# EAGLE design tvbgone (EAGLE 7.3.0)
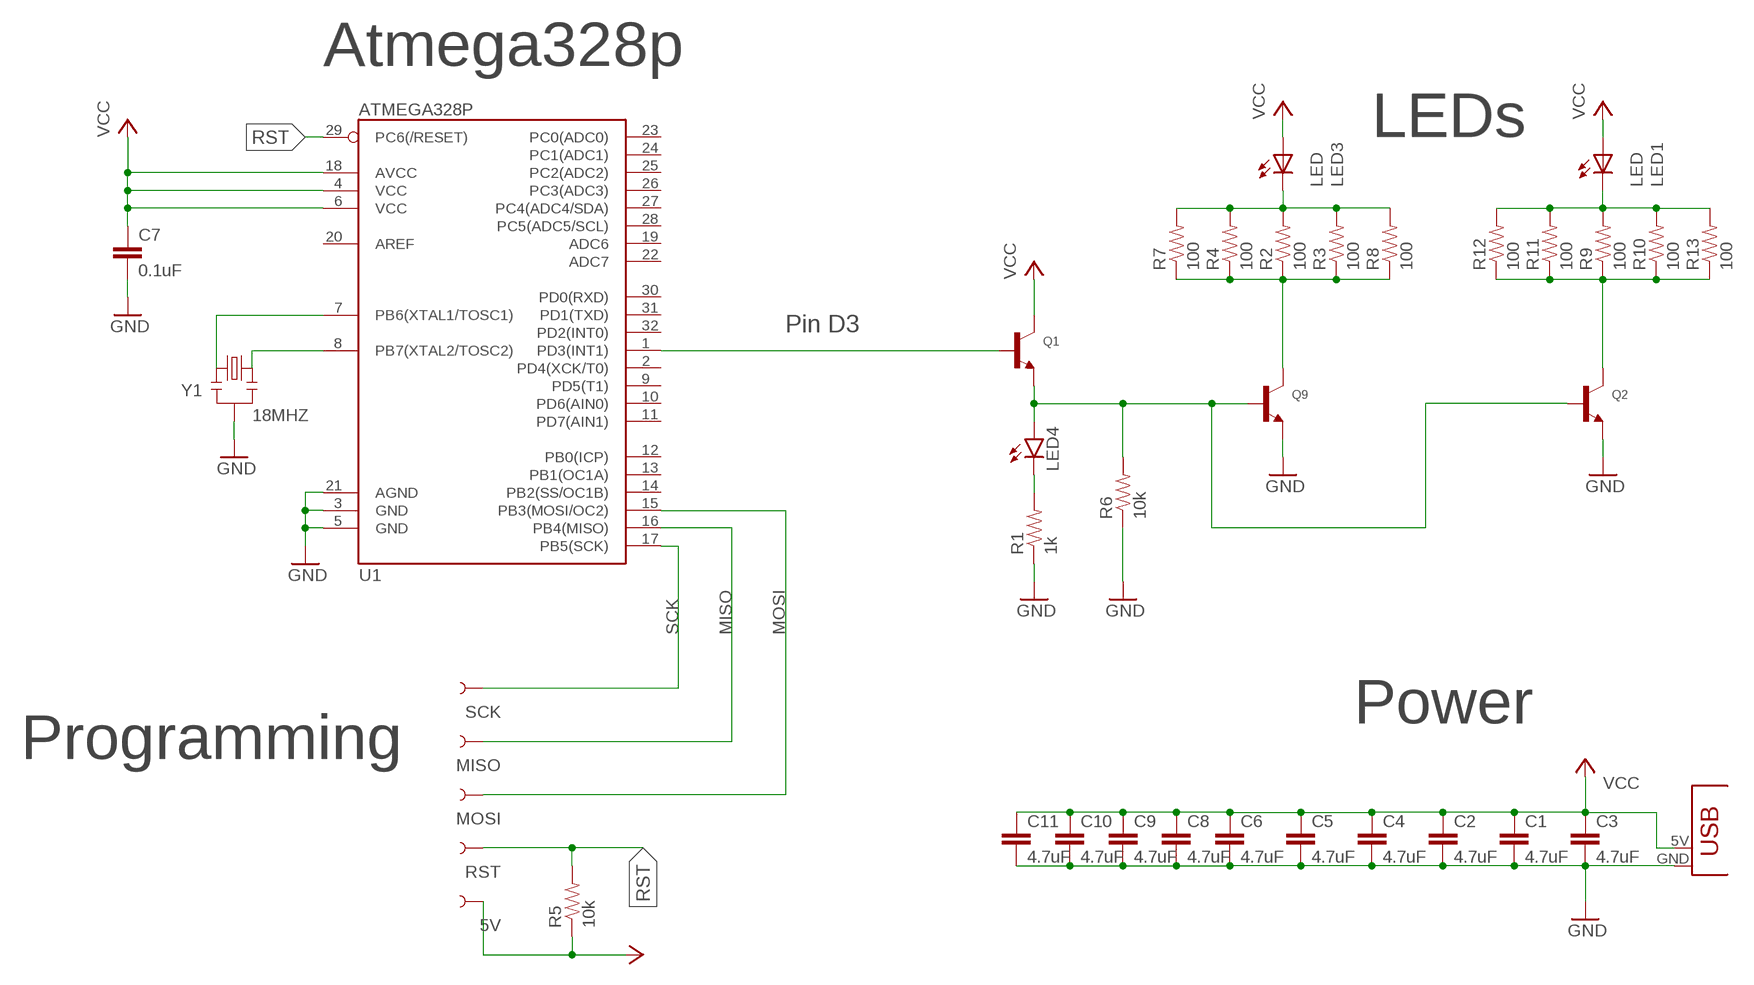
[diagram p0: schematic, sheet 1]

## Parts
5V  TEST-POINT3X5  [PAD.03X.05]
C1  4.7uF  CAP0603-CAP  [0603-CAP]
C2  4.7uF  CAP0603-CAP  [0603-CAP]
C3  4.7uF  CAP0603-CAP  [0603-CAP]
C4  4.7uF  CAP0603-CAP  [0603-CAP]
C5  4.7uF  CAP0603-CAP  [0603-CAP]
C6  4.7uF  CAP0603-CAP  [0603-CAP]
C7  0.1uF  CAP0603-CAP  [0603-CAP]
C8  4.7uF  CAP0603-CAP  [0603-CAP]
C9  4.7uF  CAP0603-CAP  [0603-CAP]
C10  4.7uF  CAP0603-CAP  [0603-CAP]
C11  4.7uF  CAP0603-CAP  [0603-CAP]
LED1  LED  [5MM-SIDE]
LED3  LED  [5MM-SIDE]
LED4  LED0603  [LED-0603]
MISO  TEST-POINT3X5  [PAD.03X.05]
MOSI  TEST-POINT3X5  [PAD.03X.05]
Q1  TRANSISTOR_NPN  [SOT-23-R]
Q2  TRANSISTOR_NPN  [SOT-23-R]
Q9  TRANSISTOR_NPN  [SOT-23-R]
R1  1k  RESISTOR0603  [0603-RES]
R2  100  RESISTOR0603  [0603-RES]
R3  100  RESISTOR0603  [0603-RES]
R4  100  RESISTOR0603  [0603-RES]
R5  10k  RESISTOR0603  [0603-RES]
R6  10k  RESISTOR0603  [0603-RES]
R7  100  RESISTOR0603  [0603-RES]
R8  100  RESISTOR0603  [0603-RES]
R9  100  RESISTOR0603  [0603-RES]
R10  100  RESISTOR0603  [0603-RES]
R11  100  RESISTOR0603  [0603-RES]
R12  100  RESISTOR0603  [0603-RES]
R13  100  RESISTOR0603  [0603-RES]
RST  TEST-POINT3X5  [PAD.03X.05]
SCK  TEST-POINT3X5  [PAD.03X.05]
U1  ATMEGA328P  ATMEGA328_SMT  [TQFP32-08]
U$1  USB-POWER-ONLY  [USB-A-PCB-POWER-ONLY]
Y1  18MHZ  RESONATOR8MHZ  [RESONATOR-SMD]

## Nets
GND: C1.2 C2.2 C3.2 C4.2 C5.2 C6.2 C7.2 C8.2 C9.2 C10.2 C11.2 Q2.3-EMITTER(E) Q9.3-EMITTER(E) R1.1 R6.1 U1.3(GND) U1.5(GND) U1.21(AGND) U$1.GND Y1.2
MISO: MISO.P$1 U1.16(PB4(MISO))
MOSI: MOSI.P$1 U1.15(PB3(MOSI/OC2))
N$1: U1.8(PB7(XTAL2/TOSC2)) Y1.3
N$2: U1.7(PB6(XTAL1/TOSC1)) Y1.1
N$3: LED4.C R1.2
N$4: Q2.2-COLLECTOR(C) R9.1 R10.1 R11.1 R12.1 R13.1
N$6: Q1.1-BASE(B) U1.1(PD3(INT1))
N$8: LED1.K(C) R9.2 R10.2 R11.2 R12.2 R13.2
N$10: LED4.A Q1.3-EMITTER(E) Q2.1-BASE(B) Q9.1-BASE(B) R6.2
N$11: Q9.2-COLLECTOR(C) R2.1 R3.1 R4.1 R7.1 R8.1
N$12: LED3.K(C) R2.2 R3.2 R4.2 R7.2 R8.2
RST: R5.2 RST.P$1 U1.29(PC6(/RESET))
SCK: SCK.P$1 U1.17(PB5(SCK))
VCC: 5V.P$1 C1.1 C2.1 C3.1 C4.1 C5.1 C6.1 C7.1 C8.1 C9.1 C10.1 C11.1 LED1.A LED3.A Q1.2-COLLECTOR(C) R5.1 U1.4(VCC) U1.6(VCC) U1.18(AVCC) U$1.5V(VBUS)
Unconnected: U1.2(PD4(XCK/T0)) U1.9(PD5(T1)) U1.10(PD6(AIN0)) U1.11(PD7(AIN1)) U1.12(PB0(ICP)) U1.13(PB1(OC1A)) U1.14(PB2(SS/OC1B)) U1.19(ADC6) U1.20(AREF) U1.22(ADC7) U1.23(PC0(ADC0)) U1.24(PC1(ADC1)) U1.25(PC2(ADC2)) U1.26(PC3(ADC3)) U1.27(PC4(ADC4/SDA)) U1.28(PC5(ADC5/SCL)) U1.30(PD0(RXD)) U1.31(PD1(TXD)) U1.32(PD2(INT0))

## Notes on the sheet
- Atmega328p
- LEDs
- Pin D3
- Power
- Programming

## Library data of the parts
5V MISO MOSI RST SCK = SparkFun-Passives:TEST-POINT: Bare copper test points for troubleshooting or ICT
C1-C11 = homemade-hardware:CAP: Capacitor Standard 0603 ceramic capacitor, and 0.1" leaded capacitor.
LED1 LED3 = tvbgone:LED
LED4 = homemade-hardware:LED: LEDs Standard schematic elements and footprints for 5mm, 3mm, 1206, and 0603 sized LEDs. 5mm - Spark Fun Electronics SKU : COM-00529 (and others)
Q1 Q2 Q9 = Tomorrow_Lab_LLC:TRANSISTOR_NPN: NPN Transistor Transistor (NPN) 500mA 45V - BC817 [Digikey: 568-1631-1-ND] SOT23-R - SOT23 footprint optimised for use with solder paste and reflow ovens. SOT23-W - SOT23 footprint optimised for hand-soldering (larger pads).
R1-R13 = homemade-hardware:RESISTOR: Resistor Basic schematic elements and footprints for 0603, 1206, and PTH resistors.
U1 = SparkFun-DigitalIC:ATMEGA328_SMT: 32-Pin Atmega328 part Commonly used on Arduino compatible boards Available in QFP and QFN packages TQFP is IC-09069 QFN is non-stock; PROD_ID: IC-09069
U$1 = Andy_Sigler:USB-POWER-ONLY
Y1 = homemade-hardware:RESONATOR: Resonator Small SMD resonator. Used, eg, on the Arduino Pro/ Pro Mini boards. 8MHz- XTAL-08895 16MHz- XTAL-08900; PROD_ID: XTAL-08895; VALUE: 8MHZ

## Board
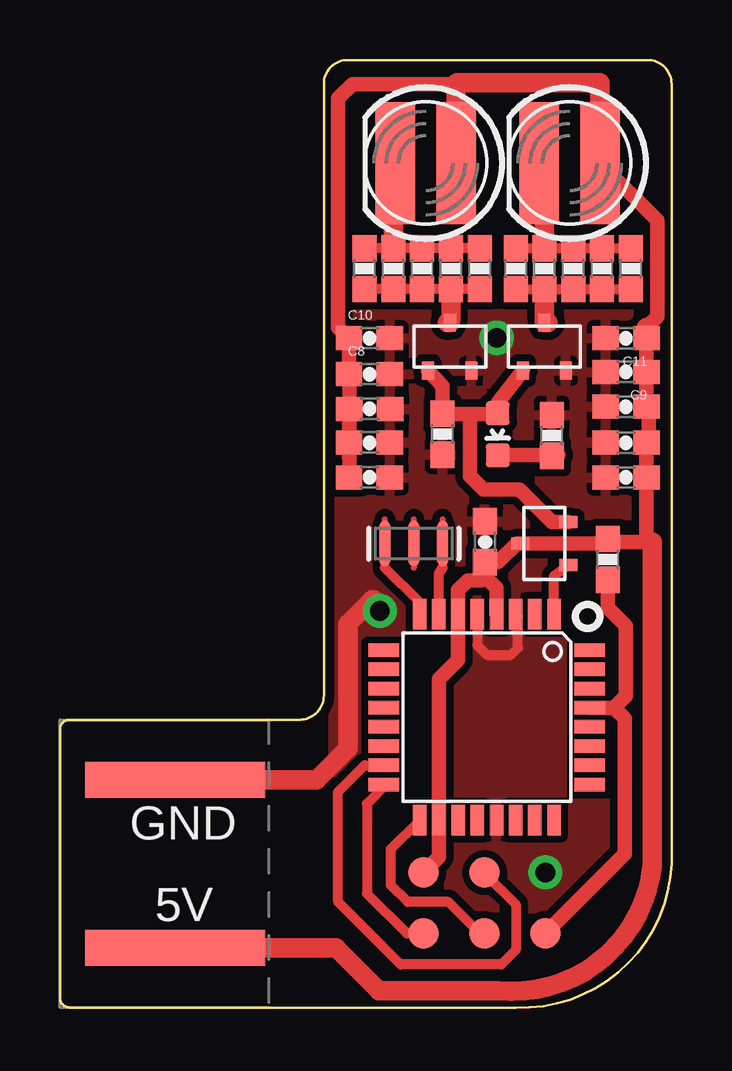
[diagram p1: board, top side]
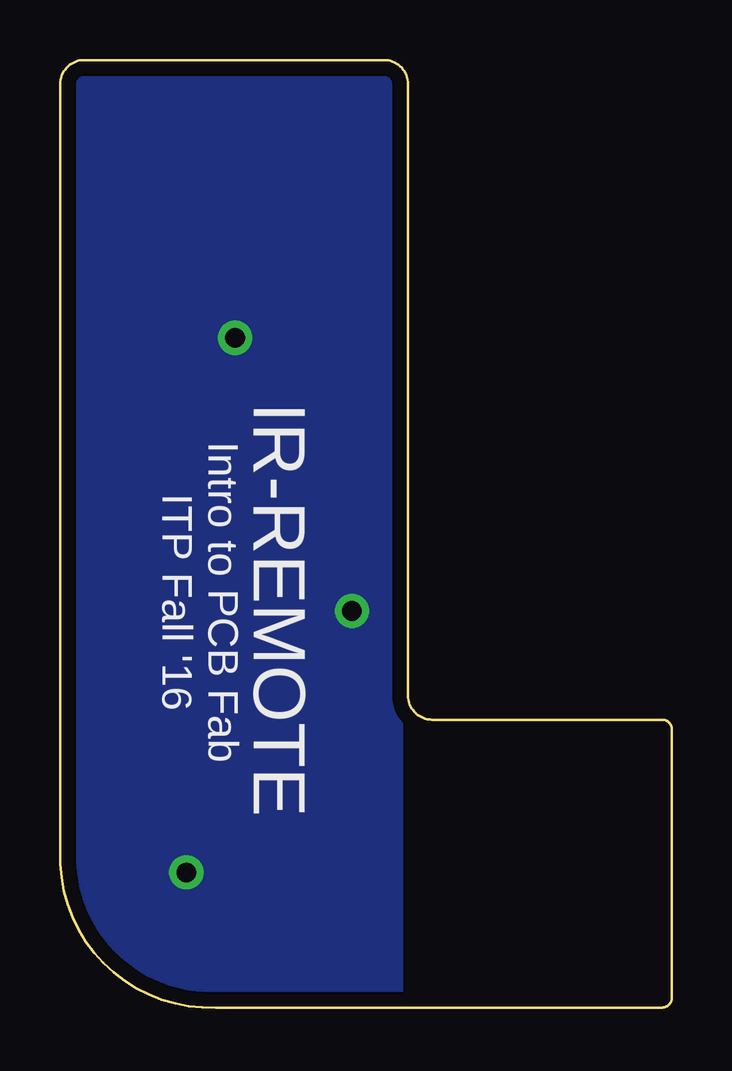
[diagram p2: board, bottom side, seen from below]

Size 25.5 x 39.5 mm. Coordinates in mm from the lower left corner, seen from the top.
Outline: 0.4,12 arc90 0,11.6 0,0.4 arc90 0.4,0 19,0 arc90 25.5,6 25.5,38.5 arc90 24.5,39.5 12,39.5 arc90 11,38.5 11,13 arc-90 10,12 0.4,12
Copper layers (1*16): Top 0.0356mm / dielectric 1.5011mm / Bottom 0.0356mm
Design rules "LaenPCBOrder": minimum track width 6mil, minimum drill 13mil, track to track 6mil, track to pad 6mil, pad to pad 6mil, via to via 6mil, smd to smd 6mil, copper to edge 15mil, drill to drill 6mil, minimum pad ring 7mil, minimum via ring 7mil, stop-mask expansion 3mil, vias tented up to drill 0mil, thermal gap 10mil

### Footprints (pad centres in the part's own frame; a part is rotated, then mirrored left to right if it is on the bottom)
PAD.03X.05 = smd 1.27 x 1.27: P$1 0,0
0603-CAP = smd 1.1 x 1: 1 -0.85,0; 2 0.85,0
5MM-SIDE = smd 1.651 x 5.08: A -1.27,0; K 1.27,0
LED-0603 = smd 1 x 1: A 0,-0.877; C 0,0.877
SOT-23-R = smd 0.5 x 0.75: 1-BASE -0.9,-1; 2-COLLECTOR 0,1; 3-EMITTER 0.9,-1
0603-RES = smd 1.1 x 1: 1 -0.85,0; 2 0.85,0
TQFP32-08 = smd 1.27 x 0.559: 1 -4.293,2.8; 2 -4.293,2; 3 -4.293,1.2; 4 -4.293,0.4; 5 -4.293,-0.4; 6 -4.293,-1.2; 7 -4.293,-2; 8 -4.293,-2.8; 17 4.293,-2.8; 18 4.293,-2; 19 4.293,-1.2; 20 4.293,-0.4; 21 4.293,0.4; 22 4.293,1.2; 23 4.293,2; 24 4.293,2.8 | smd 0.559 x 1.27: 9 -2.8,-4.293; 10 -2,-4.293; 11 -1.2,-4.293; 12 -0.4,-4.293; 13 0.4,-4.293; 14 1.2,-4.293; 15 2,-4.293; 16 2.8,-4.293; 25 2.8,4.293; 26 2,4.293; 27 1.2,4.293; 28 0.4,4.293; 29 -0.4,4.293; 30 -1.2,4.293; 31 -2,4.293; 32 -2.8,4.293
USB-A-PCB-POWER-ONLY = smd 7.5 x 1.5: 5V -0.2,-3.5; GND -0.2,3.5
RESONATOR-SMD = smd 0.45 x 1.905: 1 -1.2,0; 2 0,0; 3 1.2,0

### Placement (x,y rotation side)
5V  15.16,5.63 180 top
C1  23.6,23.55 180 top
C2  12.9,23.55 0 top
C3  12.92,24.96 0 top
C4  23.6,25.05 180 top
C5  12.9,22.1 0 top
C6  23.6,22.1 180 top
C7  17.73,19.42 90 top
C8  12.9,26.4 0 top
C9  23.6,26.5 180 top
C10  12.9,27.9 0 top
C11  23.6,27.9 180 top
LED1  15.25,35.2 180 top
LED3  21.25,35.2 180 top
LED4  18.25,23.9 180 top
MISO  15.16,3.09 180 top
MOSI  17.7,5.63 180 top
Q1  20.2,19.35 90 top
Q2  16.25,27.55 0 top
Q9  20.2,27.55 0 top
R1  20.5,23.85 270 top
R2  19,30.8 90 top
R3  20.2,30.8 90 top
R4  21.4,30.8 90 top
R5  22.83,18.68 270 top
R6  15.95,23.9 90 top
R7  22.6,30.8 90 top
R8  23.8,30.8 90 top
R9  17.5,30.8 90 top
R10  12.7,30.8 90 top
R11  15.1,30.8 90 top
R12  13.9,30.8 90 top
R13  16.3,30.8 90 top
RST  20.24,3.09 180 top
SCK  17.7,3.09 180 top
U1  17.8,12.1 270 top
U$1  5,6 0 top
Y1  14.75,19.34 180 top

### Tracks (layer width: path | path; a pad name or v marks a point on that pad's centre or on a via)
GND  (via drill 0.82 pad 1.42)
  Top 0.406: U1.5 17.4,15.1 17.8,14.7 18.8,14.7 19.1,15 19.1,16.29 U1.3
  Top 0.813: U$1.GND 10.7,9.5 12,10.8 12,16 13,17 13.07,17 v13.34,16.53
  other vias: 20.24,5.63 18.21,27.92
  pour Top (isolate 0.305): 11.4,40 27,40 27,-1 11.4,-1
  pour Bottom (isolate 0.61): 11.5,39.75 27,39.75 27,-1 11.5,-1
MISO
  Top 0.406: MISO.P$1 14.46,3.09 12.8,4.75 12.8,8.5 13.6,9.3 U1.16
MOSI
  Top 0.406: MOSI.P$1 17.7,5.6 19,4.3 19,2.4 18.4,1.8 14.2,1.8 11.6,4.4 11.6,9 12.7,10.1 U1.15
N$1
  Top 0.406: U1.8 15,16.88 13.55,18.33
N$2
  Top 0.406: U1.7 15.8,18.08 15.95,18.33
N$3
  Top 0.61: LED4.C 20.78,23.02 R1.2
N$4
  Top 0.406: R9.1 R13.1 R11.1 R12.1 R10.1
  Top 0.813: Q2.2-COLLECTOR 16.15,28.55 16.3,28.7 R13.1
N$6
  Top 0.406: U1.1 20.6,18 Q1.1-BASE
N$8
  Top 0.406: R9.2 R13.2 R11.2 R12.2 R10.2
  Top 0.813: R12.2 13.9,35.12 LED1.K
N$10
  Top 0.61: Q1.3-EMITTER 20.5,20.25 19.15,21.6 17.65,21.6 17.1,22.15 17.1,24.75 | 17.1,24.75 R6.2 15.95,25.9 Q2.1-BASE | 17.1,24.75 18.22,24.75 LED4.A 18.25,25.23 Q9.1-BASE
N$11
  Top 0.406: R2.1 R3.1 R4.1 R7.1 R8.1
  Top 0.813: Q9.2-COLLECTOR 20.35,28.55 20.2,28.7 R3.1
N$12
  Top 0.406: R2.2 R3.2 R4.2 R7.2 R8.2
  Top 0.813: R3.2 20.2,34.98 LED3.K
RST
  Top 0.406: RST.P$1 20.24,3.14 20.48,3.14
  Top 0.61: 23.1,12.5 23.55,12.05 23.55,6.4 RST.P$1 | 23.1,12.5 23.6,13 23.6,15.9 22.83,16.67 R5.2 | 23.1,12.5 U1.29
SCK
  Top 0.406: SCK.P$1 17.51,3.09 16.2,4.4 14.5,4.4 13.8,5.1 13.8,6.61 U1.17
VCC
  Top 0.406: 15.1,5.69 5V.P$1 | 24.43,4.73 24.5,4.8 24.7,5.95 | C2.1 C3.1
  Top 0.61: C2.1 12.05,24.85 | 16.5,38.5 12.2,38.5 11.6,37.9 11.6,28.35 C10.1 C8.1 12.07,26.38 C3.1 12.07,22.12 | 12.07,22.12 C2.1 | 12.07,22.12 C5.1 | 24.77,19.37 24.7,19.4 | 24.7,25 24.65,25.05 C4.1 C9.1 C11.1 | 22.96,19.4 22.5,19.4 22.4,19.35 21.65,19.35 Q1.2-COLLECTOR 19.05,19.35 18.27,18.57 C7.1 17.73,17.98 | 24.7,19.4 22.96,19.4 | 17.73,17.98 18.2,17.5 U1.4 | 17.73,17.98 17.55,17.8 17,17.8 16.6,17.4 U1.6 16.6,14.5 15.8,13.7 U1.18 15.8,6.27 5V.P$1 | R5.1 22.96,19.4 | LED3.A 24.9,32.82 24.9,28.8 24.45,28.35 | 24.55,24.95 24.55,23.55 C1.1 C6.1 24.45,19.65 24.7,19.4
  Top 0.813: LED3.A 22.5,38.55 16.55,38.55 16.5,38.5 16.5,35.22 LED1.A | U$1.5V 11.5,2.5 13.3,0.7 18.25,0.7 arc90 24.7,5.95 24.7,19.4 | 24.55,24.95 C4.1 | C11.1 24.45,28.35

### Text on the board
tPlace: GND | 5V
bPlace: IR-REMOTE | Intro to PCB Fab / ITP Fall '16